# EAGLE board FTHR-Modified Schematic (EAGLE 9.6.2)
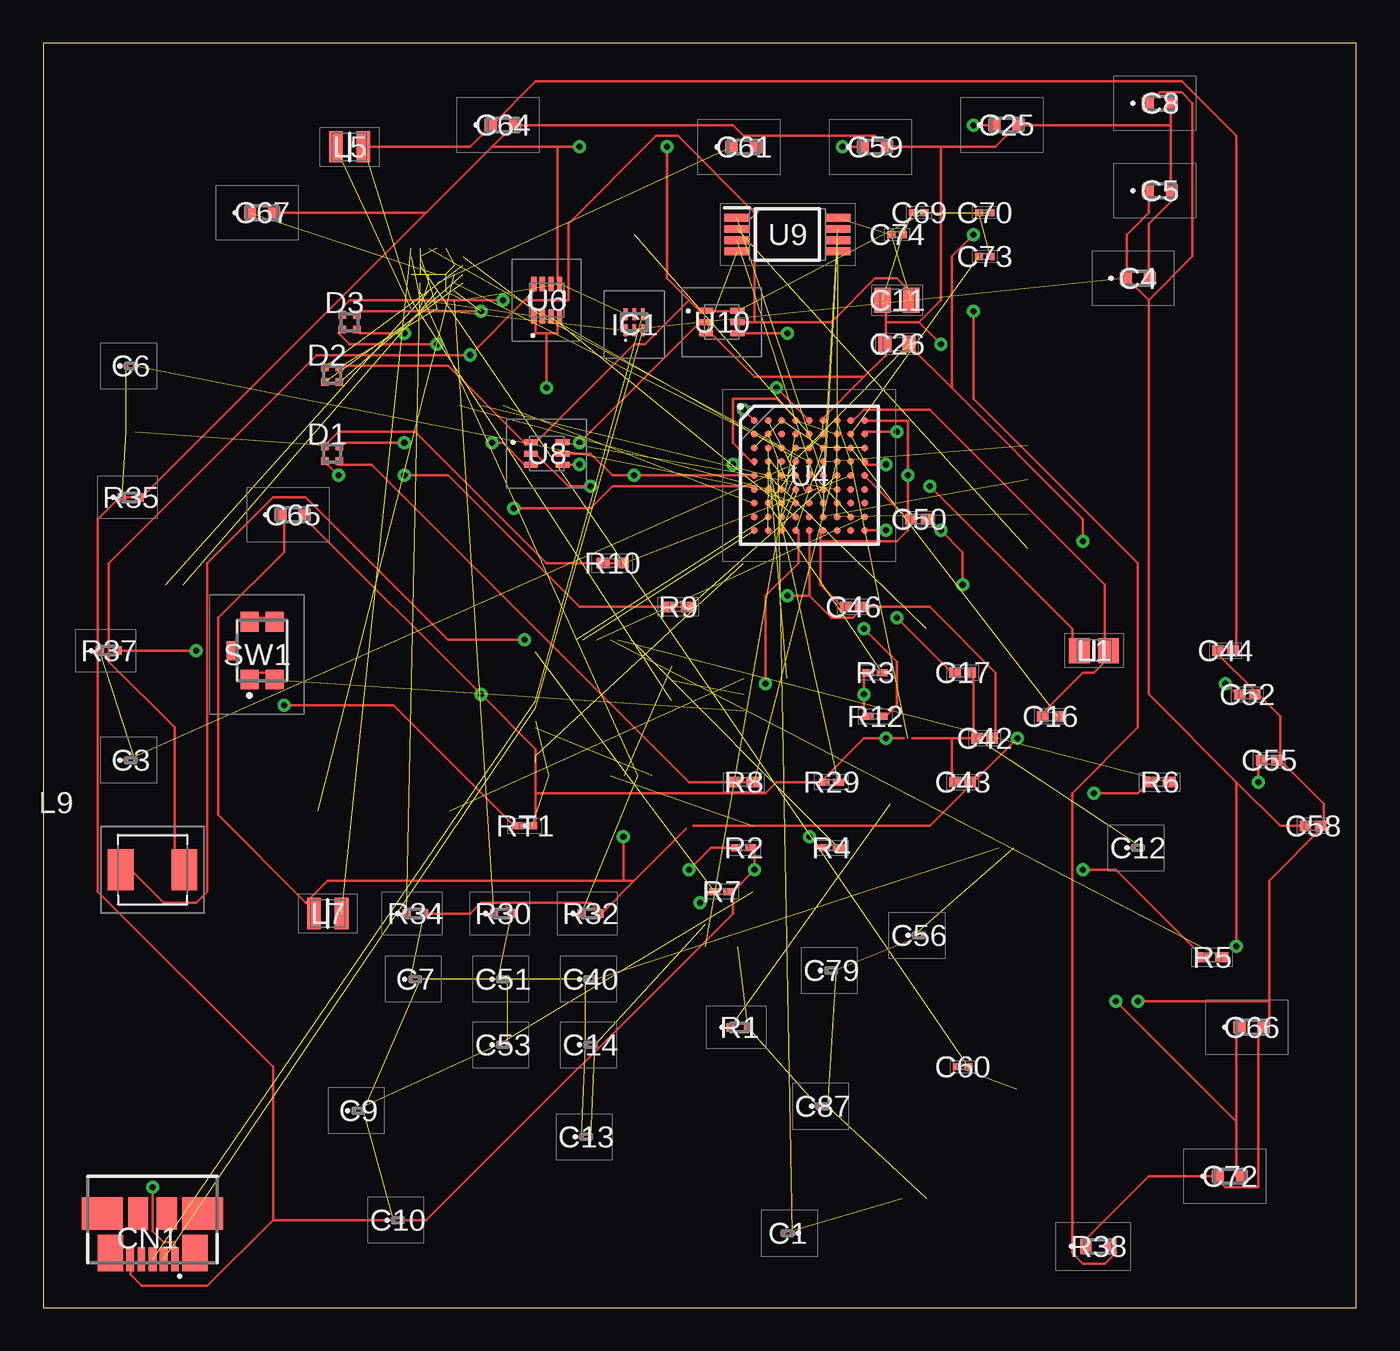
[diagram p3: board, top side]
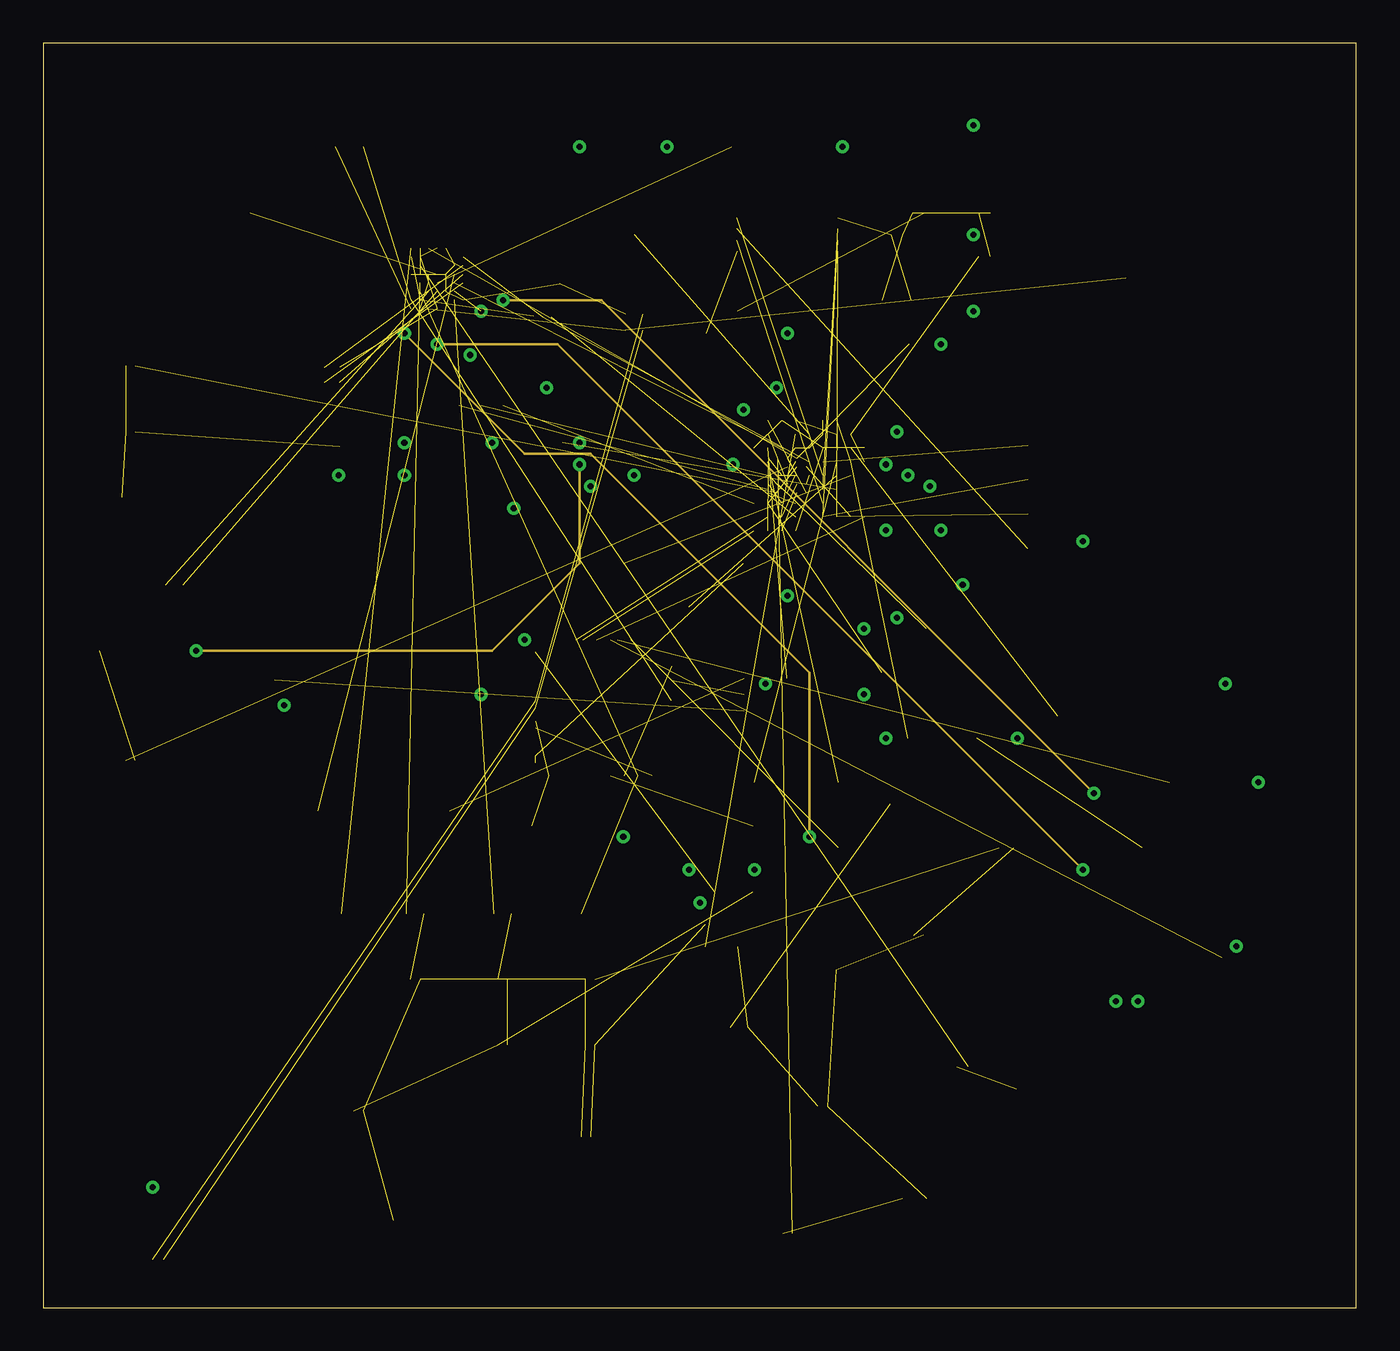
[diagram p4: board, inner layer Route2]
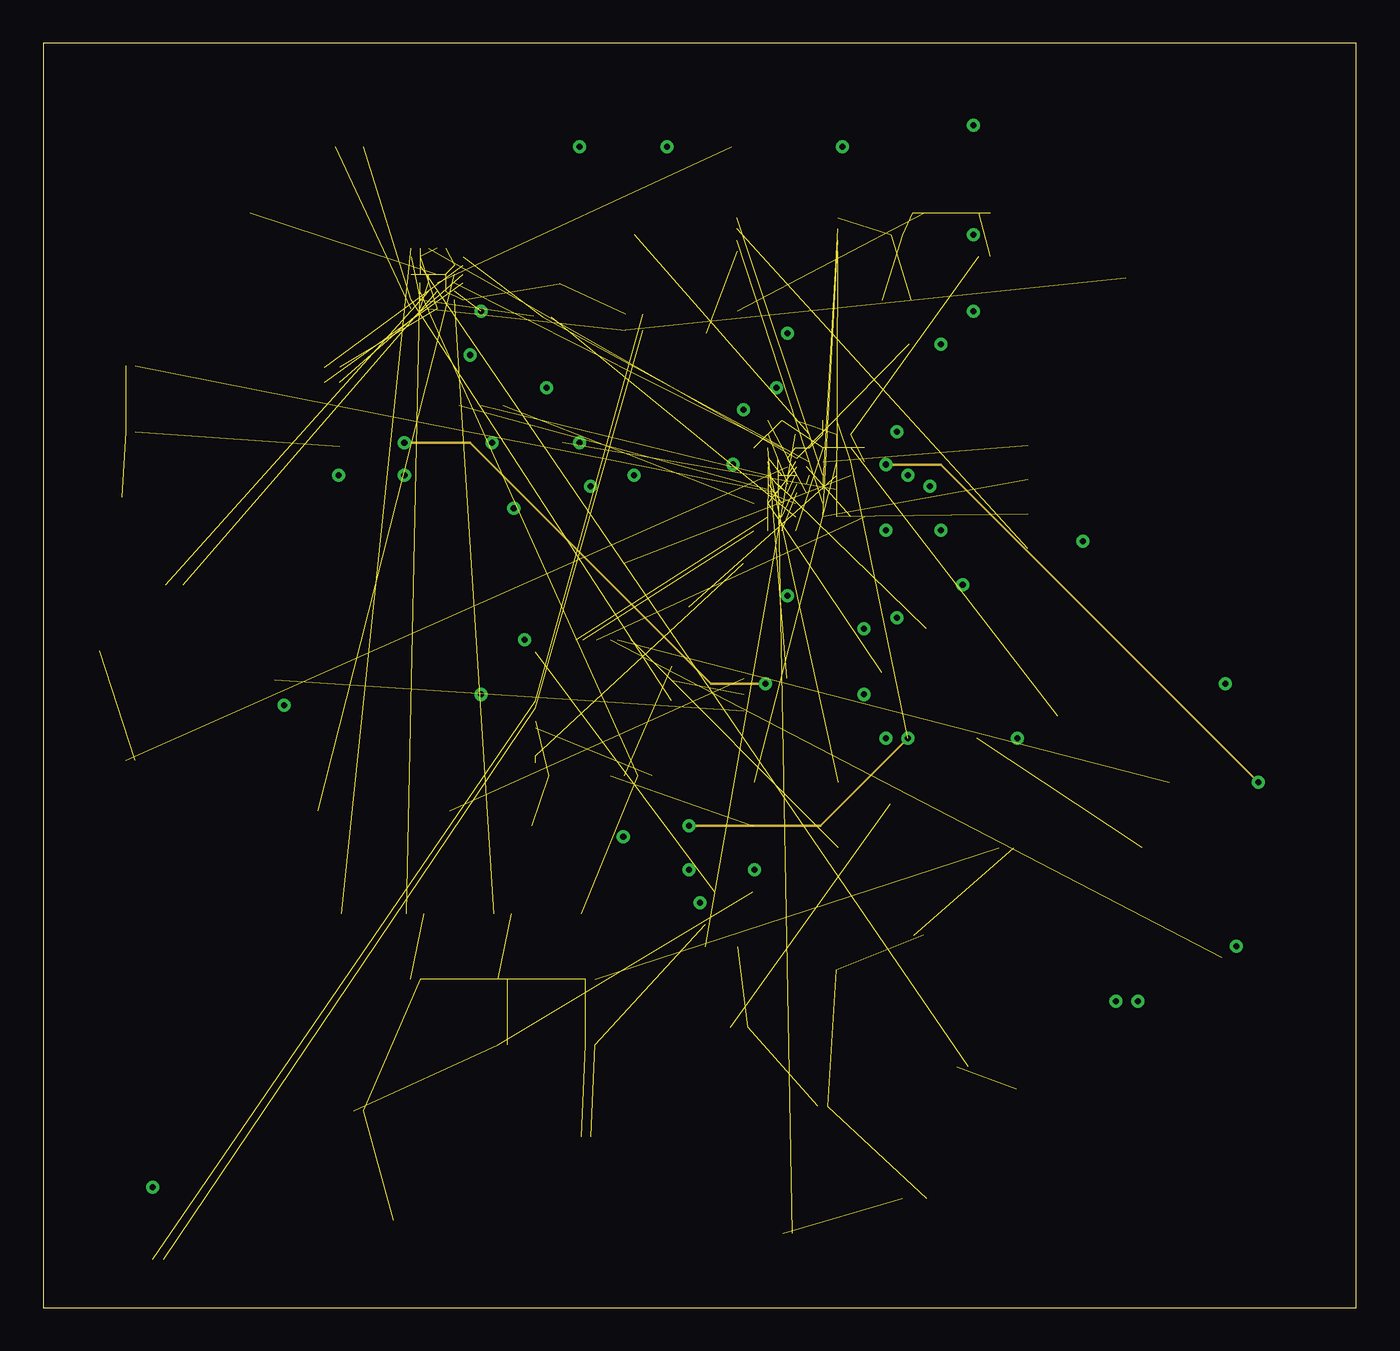
[diagram p5: board, inner layer Route15]
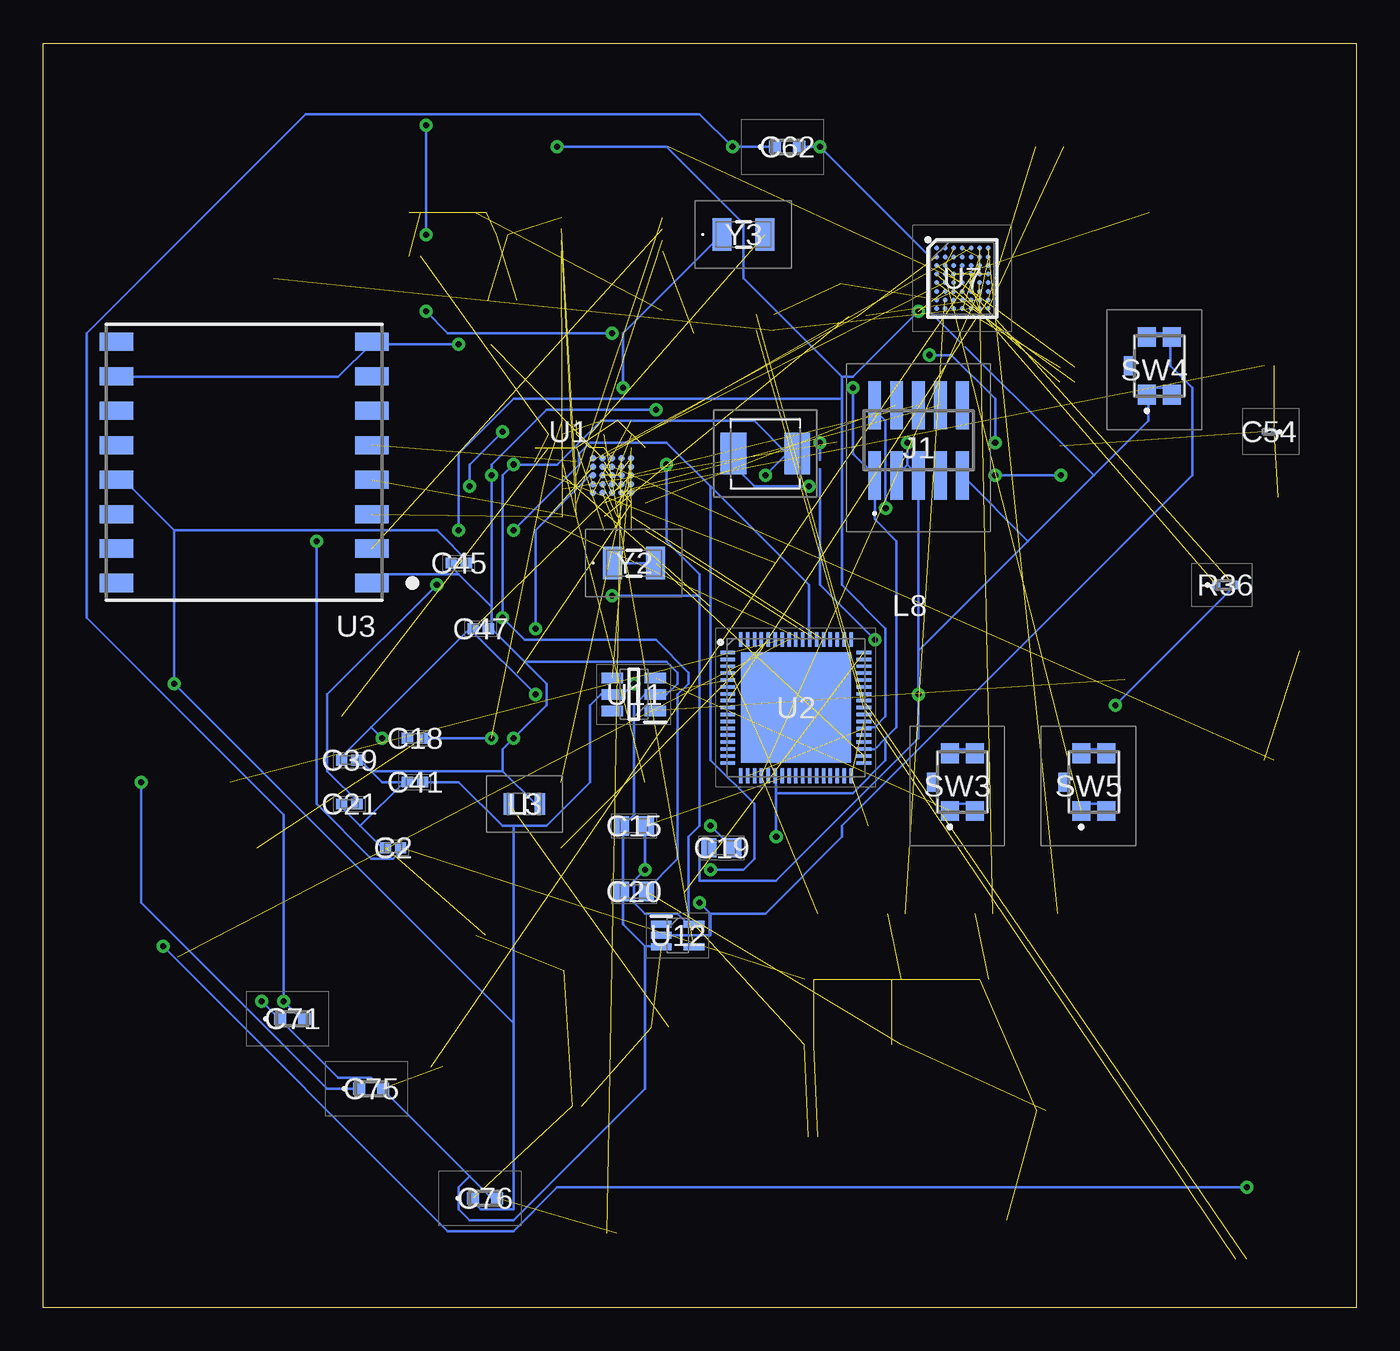
[diagram p6: board, bottom side, seen from below]

Size 76.18 x 73.33 mm. Coordinates in mm from the lower left corner, seen from the top.
Outline: 0,0 76.18,0 76.18,73.33 0,73.33 0,0
Copper layers ([2:[1+(2*15)+16:2]:15]): Top 0.035mm / dielectric 1.5mm / Route2 0.035mm / dielectric 0.15mm / Route15 0.035mm / dielectric 0.2mm / Bottom 0.035mm
Design rules "default *": minimum track width 6mil, minimum drill 0.35mm, track to track 6mil, track to pad 6mil, pad to pad 2mil, via to via 6mil, smd to smd 6mil, copper to edge 40mil, drill to drill 6mil, minimum pad ring 10mil, minimum via ring 8mil, stop-mask expansion 4mil, vias tented up to drill 0mil, thermal gap 10mil

## Footprints (pad centres in the part's own frame; a part is rotated, then mirrored left to right if it is on the bottom)
C0603_COMMERCIAL = smd 0.25 x 0.3: 1 -0.275,0; 2 0.275,0
CAPC1005X55N = smd 0.65 x 0.62: 1 -0.44,0; 2 0.44,0
C1608_COMMERCIAL = smd 0.7 x 0.7: 1 -0.7,0; 2 0.7,0
CAPC2012X145N = smd 0.97 x 1.47: 1 -0.83,0; 2 0.83,0
CAPC1608X80N = smd 0.87 x 1.12: 1 -0.72,0; 2 0.72,0
CAPC1608X90N = smd 0.75 x 0.94: 1 -0.7,0; 2 0.7,0
CAPC0603X33N = smd 0.465 x 0.42: 1 -0.332,0; 2 0.332,0
47346-0001 = smd 0.45 x 1.38: 1 1.3,-4.81; 2 0.65,-4.81; 3 0,-4.81; 4 -0.65,-4.81; 5 -1.3,-4.81 | smd 1.475 x 2.1: 6 -2.453,-4.45; 7 2.453,-4.45 | smd 1.175 x 1.9: 8 0.838,-2.15; 9 -0.838,-2.15 | smd 2.375 x 1.9: 10 2.913,-2.15; 11 -2.913,-2.15
SML-LX0404SIUPGUSB = smd 0.45 x 0.45: 1 0.425,0.425; 2 0.425,-0.425; 3 -0.425,-0.425; 4 -0.425,0.425
MAX13202EALT = smd 0.22 x 0.7: 1 -0.5,-0.46; 2 0,-0.46; 3 0.5,-0.46; 4 0.5,0.46; 5 0,0.46; 6 -0.5,0.46
FTSH10501LDVK = smd 0.74 x 2.79: 1 -2.54,0; 2 -2.54,4.07; 3 -1.27,0; 4 -1.27,4.07; 5 0,0; 6 0,4.07; 7 1.27,0; 8 1.27,4.07; 9 2.54,0; 10 2.54,4.07
INDC2012X105N = smd 1.2 x 1.45: 1 -0.85,0; 2 0.85,0
BLM21AG102BH1J = smd 0.6 x 1.25: 1 -0.9,0; 2 0.9,0
1286ASH1R0MP2 = smd 0.8 x 1.8: 1 -0.8,0; 2 0.8,0
WE-LHMI_402048 = smd 1.5 x 2.4: 1 -1.85,0; 2 1.85,0
ERJ2R_(0402) = smd 0.475 x 0.5: 1 -0.512,0; 2 0.512,0
RESC0603X28N = smd 0.625 x 0.4: 1 -0.412,0; 2 0.412,0
RESC0603X26N = smd 0.625 x 0.4: 1 -0.412,0; 2 0.412,0
RESC1005X40N = smd 0.75 x 0.6: 1 -0.55,0; 2 0.55,0
ERJ3EK_(0603) = smd 0.65 x 0.9: 1 -0.725,0; 2 0.725,0
THRMC0603X33N = smd 0.65 x 0.4: 1 -0.4,0; 2 0.4,0
EVPAA102K = smd 1.05 x 1.15: 1 -0.725,-1.675; 2 0.725,-1.675; 3 -0.725,1.675; 4 0.725,1.675 | smd 0.6 x 1.1: 5 -1.75,0
BGA25C50P5X5_347000X295000X276 = smd 0.383 x 0.383: A1 -1.1,1; A2 -0.55,1; A3 0,1; A4 0.55,1; A5 1.1,1; B1 -1.1,0.5; B2 -0.55,0.5; B3 0,0.5; B4 0.55,0.5; B5 1.1,0.5; C1 -1.1,0; C2 -0.55,0; C3 0,0; C4 0.55,0; C5 1.1,0; D1 -1.1,-0.5; D2 -0.55,-0.5; D3 0,-0.5; D4 0.55,-0.5; D5 1.1,-0.5; E1 -1.1,-1; E2 -0.55,-1; E3 0,-1; E4 0.55,-1; E5 1.1,-1
QFN40P800X800X80-69N = smd 0.85 x 0.2: 1 -3.95,3.2; 2 -3.95,2.8; 3 -3.95,2.4; 4 -3.95,2; 5 -3.95,1.6; 6 -3.95,1.2; 7 -3.95,0.8; 8 -3.95,0.4; 9 -3.95,0; 10 -3.95,-0.4; 11 -3.95,-0.8; 12 -3.95,-1.2; 13 -3.95,-1.6; 14 -3.95,-2; 15 -3.95,-2.4; 16 -3.95,-2.8; 17 -3.95,-3.2; 35 3.95,-3.2; 36 3.95,-2.8; 37 3.95,-2.4; 38 3.95,-2; 39 3.95,-1.6; 40 3.95,-1.2; 41 3.95,-0.8; 42 3.95,-0.4; 43 3.95,0; 44 3.95,0.4; 45 3.95,0.8; 46 3.95,1.2; 47 3.95,1.6; 48 3.95,2; 49 3.95,2.4; 50 3.95,2.8; 51 3.95,3.2 | smd 0.2 x 0.85: 18 -3.2,-3.95; 19 -2.8,-3.95; 20 -2.4,-3.95; 21 -2,-3.95; 22 -1.6,-3.95; 23 -1.2,-3.95; 24 -0.8,-3.95; 25 -0.4,-3.95; 26 0,-3.95; 27 0.4,-3.95; 28 0.8,-3.95; 29 1.2,-3.95; 30 1.6,-3.95; 31 2,-3.95; 32 2.4,-3.95; 33 2.8,-3.95; 34 3.2,-3.95; 52 3.2,3.95; 53 2.8,3.95; 54 2.4,3.95; 55 2,3.95; 56 1.6,3.95; 57 1.2,3.95; 58 0.8,3.95; 59 0.4,3.95; 60 0,3.95; 61 -0.4,3.95; 62 -0.8,3.95; 63 -1.2,3.95; 64 -1.6,3.95; 65 -2,3.95; 66 -2.4,3.95; 67 -2.8,3.95; 68 -3.2,3.95 | smd 6.4 x 6.4: 69 0,0
XCVR_RFM95W-868S2 = smd 1.95 x 1.05: 1 -7.4,7; 2 -7.4,5; 3 -7.4,3; 4 -7.4,1; 5 -7.4,-1; 6 -7.4,-3; 7 -7.4,-5; 8 -7.4,-7; 9 7.4,-7; 10 7.4,-5; 11 7.4,-3; 12 7.4,-1; 13 7.4,1; 14 7.4,3; 15 7.4,5; 16 7.4,7
BGA81C80P9X9_800X800X130 = smd 0.41 x 0.41: A1 -3.2,3.2; A2 -2.4,3.2; A3 -1.6,3.2; A4 -0.8,3.2; A5 0,3.2; A6 0.8,3.2; A7 1.6,3.2; A8 2.4,3.2; A9 3.2,3.2; B1 -3.2,2.4; B2 -2.4,2.4; B3 -1.6,2.4; B4 -0.8,2.4; B5 0,2.4; B6 0.8,2.4; B7 1.6,2.4; B8 2.4,2.4; B9 3.2,2.4; C1 -3.2,1.6; C2 -2.4,1.6; C3 -1.6,1.6; C4 -0.8,1.6; C5 0,1.6; C6 0.8,1.6; C7 1.6,1.6; C8 2.4,1.6; C9 3.2,1.6; D1 -3.2,0.8; D2 -2.4,0.8; D3 -1.6,0.8; D4 -0.8,0.8; D5 0,0.8; D6 0.8,0.8; D7 1.6,0.8; D8 2.4,0.8; D9 3.2,0.8; E1 -3.2,0; E2 -2.4,0; E3 -1.6,0; E4 -0.8,0; E5 0,0; E6 0.8,0; E7 1.6,0; E8 2.4,0; E9 3.2,0; F1 -3.2,-0.8; F2 -2.4,-0.8; F3 -1.6,-0.8; F4 -0.8,-0.8; F5 0,-0.8; F6 0.8,-0.8; F7 1.6,-0.8; F8 2.4,-0.8; F9 3.2,-0.8; G1 -3.2,-1.6; G2 -2.4,-1.6; G3 -1.6,-1.6; G4 -0.8,-1.6; G5 0,-1.6; G6 0.8,-1.6; G7 1.6,-1.6; G8 2.4,-1.6; G9 3.2,-1.6; H1 -3.2,-2.4; H2 -2.4,-2.4; H3 -1.6,-2.4; H4 -0.8,-2.4; H5 0,-2.4; H6 0.8,-2.4; H7 1.6,-2.4; H8 2.4,-2.4; H9 3.2,-2.4; J1 -3.2,-3.2; J2 -2.4,-3.2; J3 -1.6,-3.2; J4 -0.8,-3.2; J5 0,-3.2; J6 0.8,-3.2; J7 1.6,-3.2; J8 2.4,-3.2; J9 3.2,-3.2
MAX14595ETA = smd 0.3 x 0.95: 1 -0.75,-0.9 | smd 0.3 x 0.85: 2 -0.25,-0.95; 3 0.25,-0.95; 4 0.75,-0.95; 5 0.75,0.95; 6 0.25,0.95; 7 -0.25,0.95; 8 -0.75,0.95
BGA56C50P7X8_368X418X69 = smd 0.298 x 0.298: A1 -1.5,1.75; A2 -1,1.75; A3 -0.5,1.75; A4 0,1.75; A5 0.5,1.75; A6 1,1.75; A7 1.5,1.75; B1 -1.5,1.25; B2 -1,1.25; B3 -0.5,1.25; B4 0,1.25; B5 0.5,1.25; B6 1,1.25; B7 1.5,1.25; C1 -1.5,0.75; C2 -1,0.75; C3 -0.5,0.75; C4 0,0.75; C5 0.5,0.75; C6 1,0.75; C7 1.5,0.75; D1 -1.5,0.25; D2 -1,0.25; D3 -0.5,0.25; D4 0,0.25; D5 0.5,0.25; D6 1,0.25; D7 1.5,0.25; E1 -1.5,-0.25; E2 -1,-0.25; E3 -0.5,-0.25; E4 0,-0.25; E5 0.5,-0.25; E6 1,-0.25; E7 1.5,-0.25; F1 -1.5,-0.75; F2 -1,-0.75; F3 -0.5,-0.75; F4 0,-0.75; F5 0.5,-0.75; F6 1,-0.75; F7 1.5,-0.75; G1 -1.5,-1.25; G2 -1,-1.25; G3 -0.5,-1.25; G4 0,-1.25; G5 0.5,-1.25; G6 1,-1.25; G7 1.5,-1.25; H1 -1.5,-1.75; H2 -1,-1.75; H3 -0.5,-1.75; H4 0,-1.75; H5 0.5,-1.75; H6 1,-1.75; H7 1.5,-1.75
MAX38642AELTT = smd 0.8 x 0.35: 1 -0.915,0.65; 2 -0.915,0; 3 -0.915,-0.65; 4 0.915,-0.65; 5 0.915,0; 6 0.915,0.65
SOP65P640X110-8N = smd 1.45 x 0.45: 1 -2.925,0.975; 2 -2.925,0.325; 3 -2.925,-0.325; 4 -2.925,-0.975; 5 2.925,-0.975; 6 2.925,-0.325; 7 2.925,0.325; 8 2.925,0.975
SOT95P280X145-6N = smd 1.25 x 0.6: 1 -1.25,0.95; 2 -1.25,0; 3 -1.25,-0.95; 4 1.25,-0.95; 5 1.25,0; 6 1.25,0.95
SOT65P210X110-5N = smd 1.2 x 0.4: 1 -0.95,0.65; 2 -0.95,0; 3 -0.95,-0.65; 4 0.95,-0.65; 5 0.95,0.65
ABS0732768KHZ6T = smd 1.1 x 1.9: 1 -1.25,0; 2 1.25,0

## Placement (x,y rotation side)
C1  C0603X5R1C104K030BC  [C0603_COMMERCIAL]  43.18,4.32 180 top
C2  C0402C105K8PAC  [CAPC1005X55N]  55.88,26.67 0 bottom
C3  C0603X5R1C104K030BC  [C0603_COMMERCIAL]  5.08,31.75 0 top
C4  C1608X5R1V105K080AB  [C1608_COMMERCIAL]  63.5,59.69 0 top
C5  C1608X8R1E104K080AA  [C1608_COMMERCIAL]  64.77,64.77 0 top
C6  C0603X5R1C104K030BC  [C0603_COMMERCIAL]  5.08,54.61 0 top
C7  C0603X5R1C104K030BC  [C0603_COMMERCIAL]  21.59,19.05 0 top
C8  C1608X5R1V105K080AB  [C1608_COMMERCIAL]  64.77,69.85 0 top
C9  C0603X5R1C104K030BC  [C0603_COMMERCIAL]  18.29,11.43 0 top
C10  C0603X5R1C104K030BC  [C0603_COMMERCIAL]  20.57,5.08 0 top
C11  GRM21BR61A476ME15K  [CAPC2012X145N]  49.53,58.42 0 top
C12  C0603X5R1C104K030BC  [C0603_COMMERCIAL]  63.5,26.67 0 top
C13  C0603X5R1C104K030BC  [C0603_COMMERCIAL]  31.5,9.91 0 top
C14  C0603X5R1C104K030BC  [C0603_COMMERCIAL]  31.75,15.24 0 top
C15  CL10A226MO7JZNC  [CAPC1608X80N]  41.91,27.94 0 bottom
C16  GRM155R71H332KA01J  [CAPC1005X55N]  58.42,34.29 0 top
C17  CC0402KRX5R6BB105  [CAPC1005X55N]  53.34,36.83 0 top
C18  CC0402KRX5R6BB105  [CAPC1005X55N]  54.61,33.02 0 bottom
C19  CL10A226MO7JZNC  [CAPC1608X80N]  36.83,26.67 0 bottom
C20  CL10A226MO7JZNC  [CAPC1608X80N]  41.91,24.13 0 bottom
C21  C0402C105K8PAC  [CAPC1005X55N]  58.42,29.21 0 bottom
C25  C1608X5R1V105K080AB  [C1608_COMMERCIAL]  55.88,68.58 0 top
C26  GRM188R61A226ME15J  [CAPC1608X90N]  49.53,55.88 0 top
C39  C0402C105K8PAC  [CAPC1005X55N]  58.42,31.75 0 bottom
C40  C0603X5R1C104K030BC  [C0603_COMMERCIAL]  31.75,19.05 0 top
C41  CC0402KRX5R6BB105  [CAPC1005X55N]  54.61,30.48 0 bottom
C42  CC0402KRX5R6BB105  [CAPC1005X55N]  54.61,33.02 0 top
C43  CC0402KRX5R6BB105  [CAPC1005X55N]  53.34,30.48 0 top
C44  CC0402KRX5R6BB105  [CAPC1005X55N]  68.58,38.1 0 top
C45  C0402C105K8PAC  [CAPC1005X55N]  52.07,43.18 0 bottom
C46  C0402C105K8PAC  [CAPC1005X55N]  46.99,40.64 0 top
C47  C0402C105K8PAC  [CAPC1005X55N]  50.8,39.37 180 bottom
C50  C0402C105K8PAC  [CAPC1005X55N]  50.8,45.72 0 top
C51  C0603X5R1C104K030BC  [C0603_COMMERCIAL]  26.67,19.05 0 top
C52  CC0402KRX5R6BB105  [CAPC1005X55N]  69.85,35.56 0 top
C53  C0603X5R1C104K030BC  [C0603_COMMERCIAL]  26.67,15.24 0 top
C54  C0603X5R1C104K030BC  [C0603_COMMERCIAL]  5.08,50.8 180 bottom
C55  CC0402KRX5R6BB105  [CAPC1005X55N]  71.12,31.75 0 top
C56  C0603X5R1C104K030BC  [C0603_COMMERCIAL]  50.8,21.59 0 top
C58  CC0402KRX5R6BB105  [CAPC1005X55N]  73.66,27.94 0 top
C59  C1608X5R1V105K080AB  [C1608_COMMERCIAL]  48.26,67.31 0 top
C60  GRM033R61A105ME15W  [CAPC0603X33N]  53.34,13.97 0 top
C61  C1608X5R1V105K080AB  [C1608_COMMERCIAL]  40.64,67.31 0 top
C62  C1608X5R1V105K080AB  [C1608_COMMERCIAL]  33.02,67.31 0 bottom
C64  C1608X5R1V105K080AB  [C1608_COMMERCIAL]  26.67,68.58 0 top
C65  C1608X5R1V105K080AB  [C1608_COMMERCIAL]  14.48,45.97 0 top
C66  C1608X5R1V105K080AB  [C1608_COMMERCIAL]  70.1,16.26 0 top
C67  C1608X8R1E104K080AA  [C1608_COMMERCIAL]  12.7,63.5 0 top
C69  GRM033R61A105ME15W  [CAPC0603X33N]  50.8,63.5 0 top
C70  GRM033R61A105ME15W  [CAPC0603X33N]  54.61,63.5 0 top
C71  C1608X5R1V105K080AB  [C1608_COMMERCIAL]  61.72,16.76 0 bottom
C72  C1608X5R1V105K080AB  [C1608_COMMERCIAL]  68.83,7.62 0 top
C73  GRM033R61A105ME15W  [CAPC0603X33N]  54.61,60.96 0 top
C74  GRM033R61A105ME15W  [CAPC0603X33N]  49.53,62.23 0 top
C75  C1608X5R1V105K080AB  [C1608_COMMERCIAL]  57.15,12.7 0 bottom
C76  C1608X5R1V105K080AB  [C1608_COMMERCIAL]  50.55,6.35 0 bottom
C79  C0603X5R1A104K030BC  [C0603_COMMERCIAL]  45.72,19.56 0 top
C87  C0603X5R1A104K030BC  [C0603_COMMERCIAL]  45.21,11.68 0 top
CN1  47346-0001  [47346-0001]  6.35,7.62 0 top
D1  SML-LX0404SIUPGUSB  [SML-LX0404SIUPGUSB]  16.76,49.53 0 top
D2  SML-LX0404SIUPGUSB  [SML-LX0404SIUPGUSB]  16.76,54.1 0 top
D3  SML-LX0404SIUPGUSB  [SML-LX0404SIUPGUSB]  17.78,57.15 0 top
IC1  MAX13202EALT+  [MAX13202EALT]  34.29,57.15 0 top
J1  FTSH-105-01-L-DV-K  [FTSH10501LDVK]  25.4,48.26 0 bottom
L1  MLP2012H2R2MT0S1  [INDC2012X105N]  60.96,38.1 0 top
L3  BLM21PG221SN1J  [BLM21AG102BH1J]  48.26,29.21 0 bottom
L5  DFE201612E-2R2M=P2  [1286ASH1R0MP2]  17.78,67.31 0 top
L7  DFE201612E-2R2M=P2  [1286ASH1R0MP2]  16.51,22.86 0 top
L8  74437324022  [WE-LHMI_402048]  34.29,49.53 0 bottom
L9  74437324022  [WE-LHMI_402048]  6.35,25.4 0 top
R1  ERJ-2RKF1004X  [ERJ2R_(0402)]  40.39,16.26 0 top
R2  CRCW0201100KFKED  [RESC0603X28N]  40.64,26.67 0 top
R3  ERJ-1GEF2201C  [RESC0603X26N]  48.26,36.83 0 top
R4  CRCW0201100KFKED  [RESC0603X28N]  45.72,26.67 0 top
R5  CRCW04021K40FKED  [RESC1005X40N]  67.82,20.32 0 top
R6  CRCW04021K00FKED  [RESC1005X40N]  64.77,30.48 0 top
R7  CRCW020110K0FKED  [RESC0603X28N]  39.37,24.13 0 top
R8  CRCW04022K70FKED  [RESC1005X40N]  40.64,30.48 0 top
R9  CRCW04021K40FKED  [RESC1005X40N]  36.83,40.64 0 top
R10  CRCW04021K40FKED  [RESC1005X40N]  33.02,43.18 0 top
R12  ERJ-1GEF2201C  [RESC0603X26N]  48.26,34.29 0 top
R29  CRCW0201100KFKED  [RESC0603X28N]  45.72,30.48 0 top
R30  ERJ-2RKF1002X  [ERJ2R_(0402)]  26.67,22.86 0 top
R32  ERJ-2RKF1002X  [ERJ2R_(0402)]  31.75,22.86 0 top
R34  ERJ-2RKF1002X  [ERJ2R_(0402)]  21.59,22.86 0 top
R35  ERJ-2RKF3833X  [ERJ2R_(0402)]  5.08,46.99 0 top
R36  ERJ-2RKF1002X  [ERJ2R_(0402)]  7.62,41.91 0 bottom
R37  ERJ-2RKF3833X  [ERJ2R_(0402)]  3.81,38.1 0 top
R38  ERJ3EKF5622V  [ERJ3EK_(0603)]  61.21,3.56 0 top
RT1  NCP03XH103J05RL  [THRMC0603X33N]  27.94,27.94 0 top
SW1  EVP-AA102K  [EVPAA102K]  12.7,38.1 0 top
SW3  EVP-AA102K  [EVPAA102K]  22.86,30.48 0 bottom
SW4  EVP-AA102K  [EVPAA102K]  11.43,54.61 0 bottom
SW5  EVP-AA102K  [EVPAA102K]  15.24,30.48 0 bottom
U1  OVM7692-RYAA  [BGA25C50P5X5_347000X295000X276]  43.18,48.26 0 bottom
U2  MAX32625ITK+  [QFN40P800X800X80-69N]  32.51,34.8 0 bottom
U3  RFM95W-868S2  [XCVR_RFM95W-868S2]  64.52,49.02 180 bottom
U4  MAX78000EXG+  [BGA81C80P9X9_800X800X130]  44.45,48.26 0 top
U6  MAX14595ETA+  [MAX14595ETA]  29.21,58.42 0 top
U7  MAX20303BEWN+  [BGA56C50P7X8_368X418X69]  22.86,59.69 0 bottom
U8  MAX38642AELT+T  [MAX38642AELTT]  29.21,49.53 0 top
U9  N01S830HAT22I  [SOP65P640X110-8N]  43.18,62.23 0 top
U10  MAX38642AELT+T  [MAX38642AELTT]  39.37,57.15 0 top
U11  MAX6817EUT+T  [SOT95P280X145-6N]  41.91,35.56 180 bottom
U12  SN74LVC1G07DCKR  [SOT65P210X110-5N]  39.37,21.59 0 bottom
Y2  ABS07-32.768KHZ-6-T  [ABS0732768KHZ6T]  41.91,43.18 0 bottom
Y3  ABS07-32.768KHZ-6-T  [ABS0732768KHZ6T]  35.56,62.23 0 bottom

## Tracks (layer width: path | path; a pad name or v marks a point on that pad's centre or on a via)
1V2  (2 unrouted)
  Top 0.152: 26.04,68.58 28.57,71.12 66.04,71.12 69.22,67.94 69.22,38.1 C44.2 | 26.04,68.58 24.77,67.31 L5.2 18.41,67.31 | 26.04,68.58 C64.1
1V8  (via drill 0.35)  (6 unrouted)
  Top 0.152: 29.21,56.52 28.57,56.52 28.57,57.15 U6.1 | 29.21,56.52 29.84,56.52 29.84,57.15 U6.4 | v29.21,53.34 29.21,56.52 | 15.24,23.5 15.88,22.86 L7.1 | 15.24,23.5 10.16,28.57 10.16,40.01 13.97,43.81 13.97,45.72 C65.1 | R12.1 47.62,34.29 v47.62,35.56 47.62,36.83 R3.1 | R34.2 24.77,22.86 25.4,23.5 26.67,23.5 | 26.67,23.5 27.3,22.86 R30.2 | 32.38,22.86 31.75,23.5 26.67,23.5 | 53.98,30.48 51.44,27.94 37.47,27.94 34.29,24.77 | 32.38,22.86 34.29,24.77 | 32.38,22.86 R32.2 | 53.98,30.48 v56.52,33.02 | 53.98,30.48 C43.2 | 15.24,23.5 16.51,24.77 33.66,24.77 | 34.29,24.77 33.66,24.77 | 33.66,24.77 v33.66,27.3
  Bottom 0.152: 27.3,33.02 26.67,33.66 26.67,44.45 27.94,45.72 J1.1 29.21,49.53 v29.21,53.34 | 27.3,33.02 27.94,32.38 28.57,32.38 U2.37 | 33.66,29.84 33.66,30.48 U2.23 | 33.66,29.84 29.21,29.84 27.3,31.75 27.3,33.02 | 51.44,39.37 57.15,33.66 | 57.15,33.66 59.05,31.75 C39.1 | 51.44,39.37 v47.62,35.56 | 51.44,39.37 C47.2 | v56.52,33.02 57.15,33.66 | v33.66,27.3 33.66,29.84
2V8  (via drill 0.35)  (3 unrouted)
  Top 0.152: v60.33,44.45 60.33,45.72 52.7,53.34 | 52.7,53.34 50.16,55.88 C26.2 | v53.98,68.58 C25.1 55.24,68.58 | v53.98,62.23 52.7,60.96 52.7,53.34
  Bottom 0.152: v60.33,44.45 60.33,29.21 57.15,26.04 55.88,26.04 55.24,26.67 C2.2 | v53.98,62.23 v53.98,68.58
3V3_VREGI  (via drill 0.35)  (10 unrouted)
  Top 0.152: v68.58,36.2 69.22,35.56 C52.1 | 41.27,57.15 45.72,57.15 48.26,59.69 49.53,59.69 50.8,58.42 C11.2 | 41.27,57.15 U10.5 | v41.91,36.2 41.91,41.27 43.81,43.18 43.81,45.09 U4.J4 | v20.95,50.16 17.14,50.16 D1.1 | 27.94,58.42 v24.77,55.24 15.88,55.24 3.81,43.18 3.81,37.47 7.62,33.66 7.62,25.4 L9.2 | 27.94,58.42 28.57,59.05 U6.8 | 41.27,57.15 41.27,63.5 36.83,67.94 35.56,67.94 30.48,62.87 30.48,58.42 27.94,58.42
  Route15 0.152: v20.95,50.16 24.77,50.16 38.73,36.2 v41.91,36.2
  Bottom 0.152: 68.58,45.09 v68.58,36.2 48.9,16.51 | 68.58,45.09 71.75,48.26 U3.13 | 68.58,45.09 53.34,45.09 51.44,43.18 C45.2 | v41.91,36.2 42.55,35.56 U11.5 43.81,35.56 44.45,34.92 44.45,30.48 46.99,27.94 48.9,27.94 | C41.2 52.07,30.48 49.53,27.94 48.9,27.94 | 48.9,27.94 48.9,16.51 | 48.9,16.51 48.9,5.71 50.8,5.71 51.44,6.35 C76.1 | v24.77,55.24 23.5,55.24 20.95,52.7 v20.95,50.16
3V3_VUSB  (via drill 0.35)  (2 unrouted)
  Top 0.152: v53.34,41.91 53.34,43.81 v52.07,45.09 51.44,45.72 C50.2 | v25.4,57.78 18.41,57.78 D3.1 | v46.35,67.31 C59.1 47.62,67.31
  Bottom 0.152: v53.34,41.91 59.69,35.56 59.69,31.11 57.78,29.21 C21.2 | v25.4,57.78 29.21,53.98 29.84,53.98 | 29.84,52.7 29.84,41.91 27.3,39.37 27.3,34.29 27.94,33.66 28.57,33.66 U2.40 | 29.84,52.7 29.84,53.98 | v46.35,67.31 40.01,67.31 35.56,62.87 35.56,59.69 29.84,53.98 | v52.07,45.09 52.07,49.53 48.9,52.7 29.84,52.7
12C2_SCL  (via drill 0.35)
  Top 0.152: v47.62,39.37 49.53,37.47 49.53,34.92 48.9,34.29 R12.2
  Bottom 0.152: v47.62,39.37 47.62,45.09 44.45,48.26 U1.C1
B_LED  (1 unrouted)
DM  (2 unrouted)
DP  (2 unrouted)
EXTERNAL_RST  (via drill 0.35)  (1 unrouted)
  Top 0.152: v38.1,23.5 38.73,24.13 R7.1
  Bottom 0.152: SW4.3 12.06,56.52 10.79,56.52 SW4.4 10.79,55.88 10.79,54.61 9.53,53.34 9.53,48.26 29.84,27.94 29.84,27.3 34.29,22.86 37.47,22.86 | 37.47,22.86 v38.1,23.5 | 37.47,22.86 37.47,21.59 U12.2
G_LED  (1 unrouted)
GND  (via drill 0.35)  (41 unrouted)
  Top 0.152: 67.94,7.62 64.14,7.62 60.33,3.81 R38.1 | 70.48,35.56 67.94,38.1 C44.1 | 71.75,31.75 71.75,34.29 70.48,35.56 | 70.48,35.56 C52.2 | 74.3,27.94 74.3,29.21 71.75,31.75 | 71.75,31.75 C55.2 | 71.12,17.78 71.12,24.77 74.3,27.94 | 71.12,17.78 71.12,16.51 C66.2 70.48,16.51 70.48,6.99 68.58,6.99 67.94,7.62 | 74.3,27.94 C58.2 | 67.94,7.62 C72.1 | 71.12,17.78 v63.5,17.78 | 45.09,44.45 45.09,41.91 46.35,40.64 C46.1 | 45.09,44.45 45.09,45.09 U4.J6 | 50.16,45.72 47.62,48.26 U4.E9 | 50.16,45.72 v50.16,48.26 50.16,51.44 47.62,51.44 U4.A9 | 45.09,44.45 49.53,44.45 50.16,45.09 50.16,45.72 | 50.16,45.72 C50.1 | v40.64,52.07 U4.A1 41.27,51.44 | 45.09,30.48 47.62,33.02 v48.9,33.02 52.7,33.02 | 53.98,33.02 52.7,33.02 | 52.7,33.02 52.7,30.48 C43.1 | 53.98,33.02 53.98,36.83 C17.2 | 53.98,33.02 C42.1 | 28.57,29.84 28.57,32.38 v25.4,35.56 15.24,45.72 C65.2 | 28.57,29.84 28.57,27.94 RT1.2 | 45.09,30.48 42.55,30.48 41.91,29.84 28.57,29.84 | 45.09,30.48 R29.1 | v26.04,50.16 26.67,50.16 27.94,48.9 U8.3 | 47.62,53.98 48.9,55.24 48.9,55.88 | 47.62,53.98 45.09,51.44 U4.A6 | 47.62,53.98 41.27,53.98 38.73,56.52 U10.3 | 48.9,55.88 48.9,57.15 | 48.9,57.15 48.9,58.42 C11.1 | 48.9,55.88 C26.1 | 52.07,67.31 55.24,67.31 56.52,68.58 C25.2 65.41,68.58 | 52.07,67.31 C59.2 48.9,67.31 48.26,67.94 40.64,67.94 | 65.41,64.77 65.41,64.14 64.14,62.87 64.14,59.69 C4.2 | 65.41,64.77 65.41,68.58 | 65.41,68.58 65.41,69.85 C8.2 | 65.41,64.77 C5.2 | 50.8,57.15 48.9,57.15 | 50.8,57.15 52.07,58.42 52.07,67.31 | 50.8,57.15 v52.07,55.88 | 13.34,5.08 C10.1 20.32,5.08 | 13.34,5.08 9.53,1.27 5.71,1.27 5.08,1.91 5.08,2.54 CN1.5 | 3.17,38.1 3.17,45.72 4.45,46.99 R35.1 R35.2 5.71,46.99 22.23,63.5
  Top 0.152: 22.23,63.5 C67.2 13.34,63.5 | 26.04,67.31 27.3,68.58 C64.2 40.01,68.58 40.64,67.94 | 26.04,67.31 22.23,63.5 | 26.04,67.31 29.84,67.31 | 29.84,67.31 v31.11,67.31 | 40.64,67.94 41.27,67.31 C61.2 | 29.84,67.31 29.84,59.69 U6.5 | 13.34,5.08 13.34,13.97 3.17,24.13 3.17,38.1 | 3.17,38.1 R37.1
  Bottom 0.152: 56.52,12.7 51.44,7.62 | 51.44,7.62 50.16,6.35 C76.2 | 62.23,16.51 59.05,13.34 57.15,13.34 56.52,12.7 | 56.52,12.7 C75.2 | v63.5,17.78 62.23,16.51 | 62.23,16.51 C71.1 | 42.55,27.94 42.55,24.13 | 41.27,20.95 40.64,20.95 U12.3 | 41.27,20.95 42.55,22.23 42.55,24.13 | 42.55,24.13 C20.1 | 42.55,27.94 41.91,28.57 41.91,34.92 41.27,35.56 U11.2 40.01,35.56 39.37,36.2 39.37,36.83 40.01,37.47 48.26,37.47 | 42.55,27.94 C15.1 | 57.78,27.94 59.05,29.21 C21.1 | 57.78,27.94 56.52,26.67 C2.1 | 55.24,30.48 56.52,30.48 57.15,31.11 | 57.15,31.11 57.78,31.75 C39.2 | 49.53,31.11 47.62,29.21 L3.2 | 57.15,31.11 49.53,31.11 | 55.24,30.48 57.78,27.94 | 55.24,30.48 C41.1 | v40.64,52.07 46.99,52.07 50.16,48.9 v50.16,48.26 50.16,40.64 | 50.16,39.37 50.16,40.64 | 50.16,40.64 52.07,42.55 | 52.07,42.55 52.7,43.18 C45.1 | 52.07,42.55 56.52,42.55 U3.1 | 49.53,31.11 49.53,32.38 v48.9,33.02 46.99,34.92 46.99,36.2 48.26,37.47 | 50.16,39.37 48.26,37.47 | 50.16,39.37 C47.1 | 51.44,7.62 52.07,6.99 52.07,5.71 51.44,5.08 48.9,5.08 41.27,12.7 41.27,20.95 | SW4.2 10.79,53.34 12.06,53.34 SW4.1 12.06,52.7 12.06,51.44 15.24,48.26 | 26.04,48.9 v26.04,50.16 | 26.04,48.9 J1.5 25.4,38.1 | 25.4,38.1 v25.4,35.56 25.4,33.02 33.66,24.77 38.1,24.77 38.1,26.04 37.47,26.67 C19.1 | 25.4,38.1 19.05,44.45 | 19.05,44.45 15.24,48.26 | 19.05,44.45 J1.9 | 26.04,48.9 J1.3 | U3.10 71.75,53.98 59.05,53.98 57.15,55.88 U3.8 56.52,55.88 v52.07,55.88 | 32.38,67.31 C62.2 v31.11,67.31 24.77,60.96 24.77,57.78 15.24,48.26
GND_CHASSIS  (1 unrouted)
I2C1_SCL  (2 unrouted)
I2C1_SDA  (1 unrouted)
I2C2_SDA  (2 unrouted)
I2S_SCK/RV_TDI  (1 unrouted)
I2S_SDI  (1 unrouted)
I2S_WS/RV_TDO  (1 unrouted)
N$2
  Bottom 0.152: SW5.4 14.61,32.38 15.88,32.38 SW5.3
N$3  (1 unrouted)
N$4  (via drill 0.35)  (1 unrouted)
  Top 0.152: v13.97,34.92 20.32,34.92 27.3,27.94 RT1.1
  Bottom 0.152: v13.97,34.92 6.99,41.91 R36.2
N$5  (1 unrouted)
N$6  (1 unrouted)
N$7  (1 unrouted)
N$8  (via drill 0.35 layers 1-2)
  Top 0.152: v8.89,38.1 R37.2 | v31.11,48.9 30.48,48.9 U8.4
  Route2 0.152: v8.89,38.1 26.04,38.1 31.11,43.18 v31.11,48.9
N$9  (1 unrouted)
N$10  (1 unrouted)
N$11  (via drill 0.35)
  Top 0.152: v31.75,47.62 30.48,47.62 28.57,49.53 U8.2
  Bottom 0.152: v31.75,47.62 34.92,47.62 35.56,48.26 35.56,49.53 L8.1
N$12  (via drill 0.35)
  Top 0.152: v43.18,56.52 40.64,56.52 U10.4 | v53.98,57.78 53.98,52.7 63.5,43.18 63.5,33.66 59.69,29.84 59.69,3.17 60.33,2.54 61.59,2.54 62.23,3.17 R38.2
  Bottom 0.152: v43.18,56.52 52.7,56.52 v53.98,57.78
N$13  (via drill 0.35)
  Top 0.152: v31.11,50.16 38.1,57.15 U10.2 | v27.94,38.73 23.5,38.73 15.24,46.99 13.34,46.99 9.53,43.18 9.53,24.13 8.89,23.5 6.99,23.5 5.08,25.4 L9.1
  Bottom 0.152: v31.11,50.16 31.11,41.91 v27.94,38.73
N$14  (1 unrouted)
  Bottom 0.152: SW3.2 22.23,29.21 23.5,29.21 SW3.1
N$15  (1 unrouted)
  Top 0.152: SW1.1 12.06,36.83 13.34,36.83 SW1.2
N$16
  Bottom 0.152: SW3.4 22.23,32.38 23.5,32.38 SW3.3
N$17
  Top 0.152: SW1.3 12.06,40.01 13.34,40.01 SW1.4
N$18  (1 unrouted)
N$19  (1 unrouted)
N$20  (via drill 0.35 layers 1-2)
  Top 0.152: v20.95,56.52 18.41,56.52 D3.2 | v44.45,27.3 45.09,26.67 R4.1
  Route2 0.152: v20.95,56.52 27.94,49.53 31.75,49.53 44.45,36.83 v44.45,27.3
N$21  (via drill 0.35)
  Top 0.152: v42.55,53.34 44.45,51.44 U4.A5
  Bottom 0.152: v42.55,53.34 42.55,56.52 36.83,62.23 Y3.1
N$22  (1 unrouted)
N$23  (1 unrouted)
N$24
  Top 0.152: U4.A8 46.99,51.44 47.62,52.07 51.44,52.07 61.59,41.91 61.59,38.1 L1.2 62.23,38.1 60.96,36.83 60.33,36.83 57.78,34.29 C16.1
N$25  (1 unrouted)
N$26  (via drill 0.35)
  Top 0.152: v49.53,50.8 47.62,50.8 U4.B9 | v51.44,47.62 59.69,39.37 59.69,38.1 L1.1
  Bottom 0.152: v49.53,50.8 51.44,48.9 v51.44,47.62
N$27  (1 unrouted)
N$30  (2 unrouted)
  Bottom 0.152: 40.64,43.18 Y2.2 Y2.1 43.18,43.18
N$31  (via drill 0.35 layers 1-2)
  Top 0.152: v22.86,55.88 17.78,55.88 17.14,56.52 D3.3 | v60.33,25.4 62.23,25.4 67.31,20.32 R5.1
  Route2 0.152: v22.86,55.88 29.84,55.88 v60.33,25.4
N$32  (via drill 0.35 layers 1-2)
  Top 0.152: v26.67,58.42 17.78,58.42 17.14,57.78 D3.4 | v60.96,29.84 63.5,29.84 64.14,30.48 R6.1
  Route2 0.152: v26.67,58.42 32.38,58.42 v60.96,29.84
P0_0_UART0_RX  (via drill 0.35)
  Top 0.152: v48.9,45.09 47.62,45.09 U4.J9 | R2.1 38.73,26.67 v37.47,25.4
  Bottom 0.152: v48.9,45.09 45.09,48.9 45.09,49.53 44.45,50.16 40.01,50.16 37.47,47.62 | 37.47,47.62 31.75,41.91 31.75,38.73 U2.58 | v37.47,25.4 35.56,25.4 34.92,26.04 34.92,29.21 37.47,31.75 37.47,47.62
P0_1_UART0_TX  (1 unrouted)
P0_3_CAM_PDOWN  (1 unrouted)
P1_0_RV_TCK  (1 unrouted)
P1_1_RV_TMS  (via drill 0.35)
  Top 0.152: v27.3,46.35 31.75,46.35 33.02,47.62 41.27,47.62 U4.F1
  Bottom 0.152: v27.3,46.35 27.3,51.44 27.94,52.07 J1.2
P1_7_BUTTON_2  (1 unrouted)
P2_0_LED_R  (1 unrouted)
  Top 0.152: D1.2 17.14,48.9 19.05,48.9 37.47,30.48 40.01,30.48 R8.1 R8.2 41.27,30.48
P2_1_LED_G  (1 unrouted)
  Top 0.152: D1.4 16.51,50.16 17.14,50.8 21.59,50.8 29.21,43.18 32.38,43.18 R10.1 R10.2 33.66,43.18
P2_2_LED_B  (via drill 0.35)  (1 unrouted)
  Top 0.152: v17.14,48.26 16.51,48.9 D1.3 | v20.95,48.26 23.5,48.26 31.11,40.64 36.2,40.64 R9.1 R9.2 37.47,40.64
  Bottom 0.152: v20.95,48.26 v17.14,48.26
P2_5_BOOST_EN  (1 unrouted)
PCIF_HSYNC  (1 unrouted)
PCIF_IO0  (1 unrouted)
PCIF_IO1  (1 unrouted)
PCIF_IO2  (1 unrouted)
PCIF_IO3  (1 unrouted)
PCIF_IO4  (1 unrouted)
PCIF_IO5  (1 unrouted)
PCIF_IO6  (1 unrouted)
PCIF_IO7  (1 unrouted)
PCIF_VSYNC  (1 unrouted)
PCIF_XCLK  (1 unrouted)
PCIF_XVCLK  (1 unrouted)
PMIC_ALRT_N  (1 unrouted)
PMIC_INT  (1 unrouted)
PMIC_LED0  (1 unrouted)
PMIC_LED1  (1 unrouted)
PMIC_LED2  (1 unrouted)
PMIC_PFN1  (1 unrouted)
  Bottom 0.152: SW5.2 14.61,29.21 15.88,29.21 SW5.1
PMIC_PFN2  (1 unrouted)
QSPI0_SDIO2  (1 unrouted)
QSPI0_SDIO3  (1 unrouted)
QSPI0_SS1  (1 unrouted)
R_LED  (1 unrouted)
RST_N  (2 unrouted)
SD_SPI_DI  (2 unrouted)
SD_SPI_DO  (1 unrouted)
SD_SPI_SCLK  (2 unrouted)
SRAM_CS  (1 unrouted)
SWDCLK  (1 unrouted)
SWDIO  (1 unrouted)
SYS_OUT  (via drill 0.35)  (5 unrouted)
  Top 0.152: 69.22,10.79 69.22,16.51 C66.1 | 69.22,10.79 69.22,7.62 C72.2 | 69.22,10.79 v62.23,17.78 | D2.1 17.14,54.61 23.5,54.61 27.94,50.16 U8.1 28.57,50.16 34.29,55.88 34.92,55.88 37.47,58.42 | v36.2,67.31 36.2,59.69 37.47,58.42 | 37.47,58.42 38.1,57.78 U10.1 38.73,57.78 40.01,57.78 U10.6
  Bottom 0.152: C71.2 60.96,16.51 v62.23,17.78 62.23,28.57 73.66,40.01 73.66,56.52 60.96,69.22 38.1,69.22 v36.2,67.31 C62.1 33.66,67.31
VBUS  (via drill 0.35)  (2 unrouted)
  Top 0.152: C58.1 71.75,27.94 69.22,30.48 | 69.22,30.48 64.14,35.56 64.14,58.42 | 62.87,59.69 64.14,58.42 | 62.87,59.69 62.87,62.23 64.14,63.5 64.14,64.77 C5.1 | 62.87,59.69 C4.1 | 64.14,58.42 66.67,60.96 66.67,69.85 66.04,70.48 64.77,70.48 64.14,69.85 C8.1 | v6.35,6.99 6.35,4.45 6.99,3.81 7.62,3.81 7.62,3.17 CN1.1 | 69.22,30.48 v69.22,20.95
  Bottom 0.152: v6.35,6.99 46.35,6.99 48.9,4.45 52.7,4.45 v69.22,20.95
VCOREA  (via drill 0.35)  (4 unrouted)
  Top 0.152: v70.48,30.48 70.48,31.75 C55.1 | U8.5 31.75,49.53 33.02,48.26 v34.29,48.26 U4.E1 41.27,48.26 | v48.9,48.9 47.62,48.9 U4.D9 | v49.53,40.01 52.7,36.83 C17.1
  Route15 0.152: v70.48,30.48 52.07,48.9 v48.9,48.9
  Bottom 0.152: v70.48,30.48 70.48,23.5 59.69,12.7 C75.1 57.78,12.7 | 33.02,49.53 34.92,51.44 43.81,51.44 46.35,48.9 v48.9,48.9 49.53,48.26 v49.53,40.01 48.26,38.73 40.64,38.73 38.73,36.83 38.73,36.2 39.37,35.56 39.37,26.04 41.27,24.13 C20.2 | 33.02,49.53 v34.29,48.26 | 33.02,49.53 L8.2
VREGO_A  (via drill 0.35)  (5 unrouted)
  Top 0.152: C10.2 22.23,5.08 40.01,22.86 40.01,24.13 | 40.01,24.13 v41.27,25.4 41.27,26.67 R2.2 | 40.01,24.13 R7.2 | 44.45,41.27 U4.J5 44.45,45.09 | 44.45,41.27 45.72,40.01 46.99,40.01 47.62,40.64 | 47.62,40.64 51.44,40.64 55.24,36.83 55.24,33.02 C42.2 | 47.62,40.64 C46.2 | 40.64,49.53 40.01,50.16 40.01,52.7 42.55,52.7 43.81,51.44 U4.A4 | 40.64,49.53 41.27,48.9 U4.D1 | v40.01,48.9 40.64,49.53 | v43.18,41.27 44.45,41.27
  Bottom 0.152: 38.73,22.23 39.37,22.86 41.27,22.86 41.91,23.5 41.91,24.77 v41.27,25.4 41.27,27.94 C15.2 | v40.01,48.9 40.01,44.45 38.1,42.55 38.1,41.27 | 38.1,41.27 38.1,27.94 38.73,27.3 38.73,22.23 | 38.73,22.23 U12.5 | 38.1,41.27 v43.18,41.27
VREGO_B  (via drill 0.35 layers 15-16)  (3 unrouted)
  Route15 0.152: v50.16,33.02 45.09,27.94 v37.47,27.94
  Bottom 0.152: v50.16,33.02 C18.2 | v37.47,27.94 36.2,26.67 C19.2